# Altium schematic sheet IO_driver.SchDoc
size 410 x 297 mm; SheetNumber: 2; SheetTotal: 2
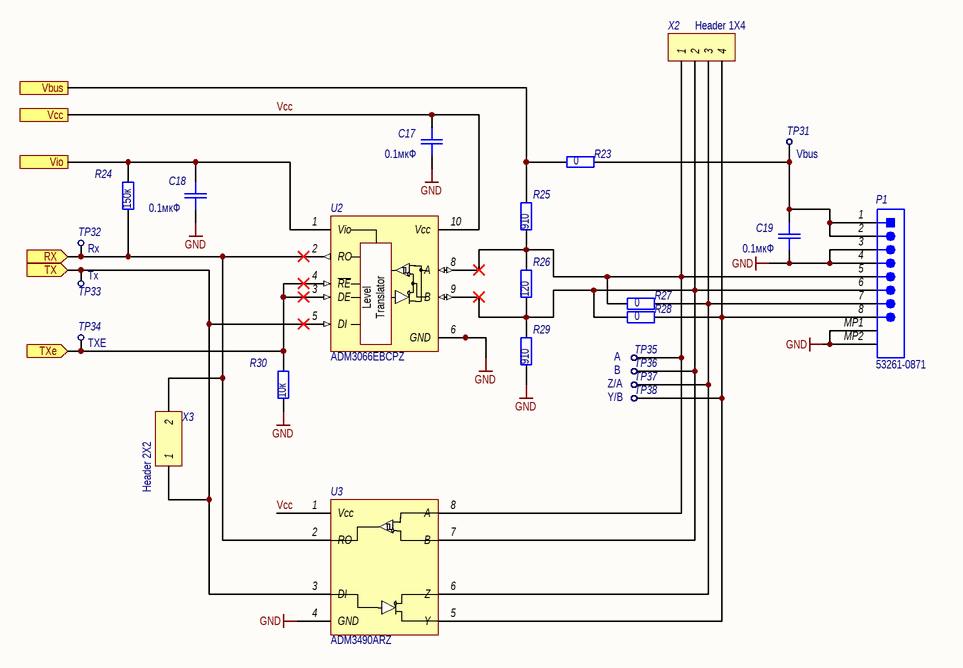
[diagram p0: IO_driver.SchDoc]

## Parts
C17  0.1мкФ  [SMD_C0603]
C18  0.1мкФ  [SMD_C0603]
C19  0.1мкФ  [SMD_C0603]
P1  PicoBlade_53261-0871  [53261-0871]  (value not drawn)
R23  value 0  [SMD_0603]  (hidden comment: OSM R1-8)
R24  150к  [SMD_0603]
R25  910  [SMD_0603]
R26  120  [SMD_0603]
R27  value 0  [SMD_0603]  (hidden comment: OSM R1-8)
R28  value 0  [SMD_0603]  (hidden comment: OSM R1-8)
R29  910  [SMD_0603]
R30  10к  [SMD_0603]
TP31  Vbus  [TP_PAD_1]
TP32  Rx  [TP_PAD_1]
TP33  Tx  [TP_PAD_1]
TP34  TXE  [TP_PAD_1]
TP35  A  [TP_PAD_1]
TP36  B  [TP_PAD_1]
TP37  Z/A  [TP_PAD_1]
TP38  Y/B  [TP_PAD_1]
U2  ADM3066EBCPZ  [LFCSP-10_3x3]
U3  ADM3490ARZ  [SOIC-8]
X2  Header 1X4  [PLS-4]
X3  Header 2X2  [PLD2-2]

## Ports
RX (in, see main[3A]), TX (in, see main[3A]), TXe (in, see main[3A]), Vbus (see main[3A]), Vcc (see main[3A]), Vio (see main[3A])

## Nets
GND: C17.1 C18.1 C19.1 P1.3 P1.4 P1.MP1 P1.MP2 R29.2 R30.2 U2.6(GND) U2.11(GND) U3.4(GND)
RX: R24.2 TP32.0(TP) U2.2(RO) U3.2(RO) X3.2 ; port RX
TX: TP33.0(TP) U2.5(DI) U3.3(DI) X3.1 ; port TX
TXe: R30.1 TP34.0(TP) U2.3(DE) U2.4(~{RE}) ; port TXe
Vbus: R23.1 R25.1 ; port Vbus
Vcc: C17.2 U2.10(Vcc) U3.1(Vcc) ; port Vcc
Vio: C18.2 R24.1 U2.1(Vio) ; port Vio
NetC19_2: C19.2 P1.1 P1.2 R23.2 TP31.0(TP)
NetP1_5: P1.5 R25.2 R26.1 R27.1 TP35.0(TP) U2.8(A) U3.8(A) X2.1
NetP1_6: P1.6 R26.2 R28.1 R29.1 TP36.0(TP) U2.9(B) U3.7(B) X2.2
NetP1_7: P1.7 R27.2 TP37.0(TP) U3.6(Z) X2.3
NetP1_8: P1.8 R28.2 TP38.0(TP) U3.5(Y) X2.4

## Notes on the sheet
- Подп. и дата
- Инв. № дубл.
- Взам. инв. №
- Инв. № подл.
- Изм.
- Лист
- № докум.
- Подп.
- Дата
- Форма 2а ГОСТ 2.104-2006
- Копировал
- Формат А3
- (in symbol ADM3066E) Level; Translator

## Library data of the parts
C17-C19 = Capacitor: Назначение: SMD-конденсатор; Наименование: Конденсатор; Потребление, Вт: 0; Value: 0.1мкФ; Place_v1: *; Plcae_v2: *
P1 = PicoBlade_53261-0871: Male Header, Pitch 1.25 mm, 1 x 8 Position, Height 3.4 mm, -40 to 85 degC, RoHS, Tape and Reel; Потребление, Вт: 0.0; Назначение: Male Header, Pitch 1.25 mm, 1 x 8 Position, Height 3.4 mm, -40 to 85 degC, RoHS, Tape and Reel; ComponentLink1Description: DataSheet; ComponentLink1URL: http://www.molex.com/pdm_docs/sd/532610671_sd.pdf; Наименование: 53261-0871
R23 R27 R28 = Resistor: Наименование: ОСМ Р1-12; Назначение: SMD-резистор; Потребление, Вт: 0,001; Точность: %
R24-R26 R29 R30 = Resistor: Наименование: Резистор; Назначение: SMD-резистор; Потребление, Вт: 0,001; Place_v1: *; Plcae_v2: *
  R24: Value: 150к
  R25 R29: Value: 910
  R26: Value: 120
  R30: Value: 10к
TP31-TP38 = TP: Наименование: Точка проверки; Назначение: Контроль параметров платы
  TP31: TP_Name: Vbus
  TP32: TP_Name: Rx
  TP33: TP_Name: Tx
  TP34: TP_Name: TXE
  TP35: TP_Name: A
  TP36: TP_Name: B
  TP37: TP_Name: Z/A
  TP38: TP_Name: Y/B
U2 = ADM3066E: 3.0 V to 5.5 V, ±12 kV IEC ESD Protected, 500 kbps/50 Mbps RS-485 Transceiver; Потребление, Вт: 0,1; Наименование: ADM3066EBCPZ; Назначение: RS-485 Transceiver
U3 = ADM3490: 3.3 V Slew Rate Limited, Half- and / Full-Duplex, RS-485/RS-422 Transceivers; Наименование: ADM3066EBCPZ; Назначение: RS-485 Transceiver; Потребление, Вт: 0,1
X2 = Header 1X4: Header, 4-Pin, Single row; Потребление, Вт: 0,0; Назначение: Header, 4-Pin, Single row; Наименование: Header 1X4
X3 = Header 2X2: Header, 2-Pin, Dual row; Потребление, Вт: 0,0; Назначение: Header, 2-Pin, Dual row; Наименование: Header 2X2